# EAGLE design mhvboard (EAGLE 5.10)
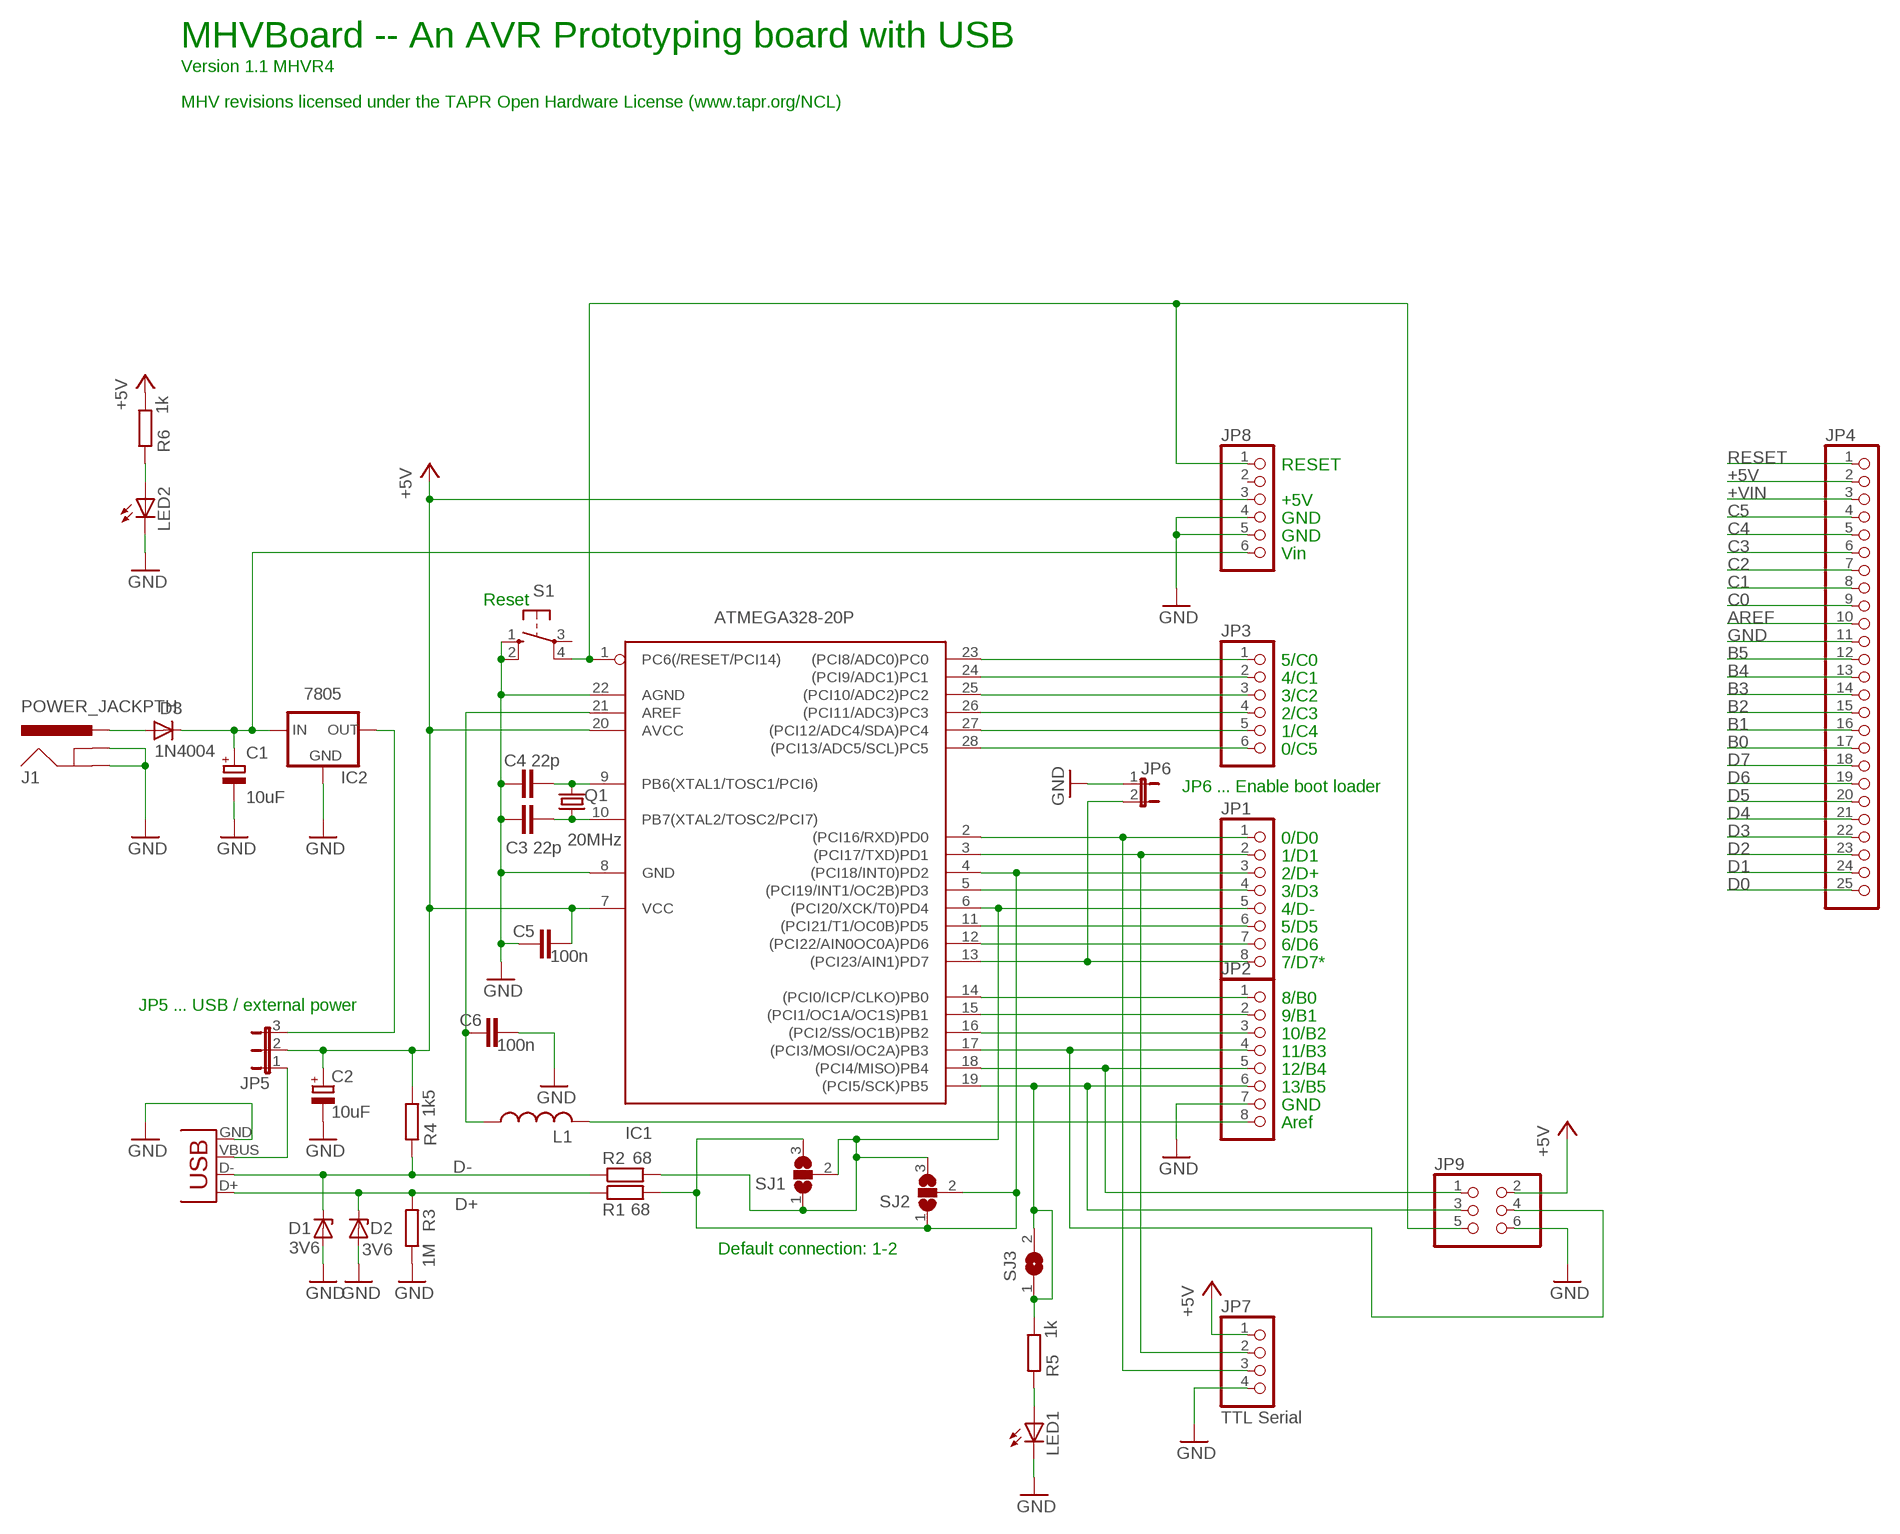
[diagram p0: schematic, sheet 1]

## Parts
C1  10uF  CPOL-EUE2,5-6E  [E2,5-6E]
C2  10uF  CPOL-EUE2,5-6E  [E2,5-6E]
C3  22p  C-EU025-024X044  [C025-024X044]
C4  22p  C-EU025-024X044  [C025-024X044]
C5  100n  C-EU050-024X044  [C050-024X044]
C6  100n  C-EU050-024X044  [C050-024X044]
D1  3V6  ZENER-DIODEDO34-7  [DO34Z7]
D2  3V6  ZENER-DIODEDO34-7  [DO34Z7]
D3  1N4004  [DO41-10]
IC1  ATMEGA328-20P  ATMEGA168-20P  [DIL28-3]
IC2  7805  78XXL  [78XXL]
J1  POWER_JACKPTH  [POWER_JACK_PTH]
JP1  PINHD-1X8  [1X08]
JP2  PINHD-1X8  [1X08]
JP3  PINHD-1X6  [1X06]
JP4  PINHD-1X25  [1X25]
JP5  JP2E  [JP2]
JP6  JP1E  [JP1]
JP7  TTL Serial  PINHD-1X4  [1X04]
JP8  PINHD-1X6  [1X06]
JP9  PINHD-2X3  [2X03]
L1  L-US0207/2V  [0207/2V]
LED1  LED3MM  [LED3MM]
LED2  LED3MM  [LED3MM]
Q1  20MHz  CRYSTALHC49S  [HC49/S]
R1  68  R-EU_0207/10  [0207/10@1]
R2  68  R-EU_0207/10  [0207/10@1]
R3  1M  R-EU_0207/10  [0207/10@1]
R4  1k5  R-EU_0207/10  [0207/10@1]
R5  1k  R-EU_0207/2V  [0207/2V@1]
R6  1k  R-EU_0207/2V  [0207/2V@1]
S1  10-XX  [B3F-10XX]
SJ1  SJ2W  [SJ_2]
SJ2  SJ2W  [SJ_2]
SJ3  SJ  [SJ]
X1  USB-MB-H  [USB-MB-H]

## Nets
+5USB: JP5.1 X1.VBUS
+5V: C2.+ C5.2 IC1.7(VCC) IC1.20(AVCC) JP4.2 JP5.2 JP7.1 JP8.3 JP9.2 R4.1 R6.1
+VIN: C1.+ D3.C IC2.IN JP4.3 JP8.6
AREF: JP2.8 JP4.10 L1.2
AREF_RAW: C6.1 IC1.21(AREF) L1.1
B0: IC1.14((PCI0/ICP/CLKO)PB0) JP2.1 JP4.17
B1: IC1.15((PCI1/OC1A/OC1S)PB1) JP2.2 JP4.16
B2: IC1.16((PCI2/SS/OC1B)PB2) JP2.3 JP4.15
B3: IC1.17((PCI3/MOSI/OC2A)PB3) JP2.4 JP4.14 JP9.4
B4: IC1.18((PCI4/MISO)PB4) JP2.5 JP4.13 JP9.1
B5: IC1.19((PCI5/SCK)PB5) JP2.6 JP4.12 JP9.3 R5.1 SJ3.1 SJ3.2
C0: IC1.23((PCI8/ADC0)PC0) JP3.1 JP4.9
C1: IC1.24((PCI9/ADC1)PC1) JP3.2 JP4.8
C2: IC1.25((PCI10/ADC2)PC2) JP3.3 JP4.7
C3: IC1.26((PCI11/ADC3)PC3) JP3.4 JP4.6
C4: IC1.27((PCI12/ADC4/SDA)PC4) JP3.5 JP4.5
C5: IC1.28((PCI13/ADC5/SCL)PC5) JP3.6 JP4.4
D0: IC1.2((PCI16/RXD)PD0) JP1.1 JP4.25 JP7.3
D1: IC1.3((PCI17/TXD)PD1) JP1.2 JP4.24 JP7.2
D2: IC1.4((PCI18/INT0)PD2) JP1.3 JP4.23 R1.2 SJ1.3 SJ2.1 SJ2.2
D3: IC1.5((PCI19/INT1/OC2B)PD3) JP1.4 JP4.22
D4: IC1.6((PCI20/XCK/T0)PD4) JP1.5 JP4.21 R2.2 SJ1.1 SJ1.2 SJ2.3
D5: IC1.11((PCI21/T1/OC0B)PD5) JP1.6 JP4.20
D6: IC1.12((PCI22/AIN0OC0A)PD6) JP1.7 JP4.19
D7: IC1.13((PCI23/AIN1)PD7) JP1.8 JP4.18 JP6.2
D+: D2.C R1.1 R3.2 X1.D+
D-: D1.C R2.1 R4.2 X1.D-
GND: C1.- C2.- C3.1 C4.1 C5.1 C6.2 D1.A D2.A IC1.8(GND) IC1.22(AGND) IC2.GND J1.GND J1.GNDBREAK JP2.7 JP4.11 JP6.1 JP7.4 JP8.4 JP8.5 JP9.6 LED1.K(C) LED2.K(C) R3.1 S1.1(S) S1.2(S1) X1.GND
N$1: LED1.A R5.2
N$2: LED2.A R6.2
N$4: D3.A J1.PWR
N$8: IC2.OUT JP5.3
N$9: C3.2 IC1.10(PB7(XTAL2/TOSC2/PCI7)) Q1.1
N$10: C4.2 IC1.9(PB6(XTAL1/TOSC1/PCI6)) Q1.2
RESET: IC1.1(PC6(/RESET/PCI14)) JP4.1 JP8.1 JP9.5 S1.4(P1)
Unconnected: JP8.2 S1.3(P)

## Notes on the sheet
- MHVBoard -- An AVR Prototyping board with USB
- Version 1.1 MHVR4
- MHV revisions licensed under the TAPR Open Hardware License (www.tapr.org/NCL)
- RESET
- +5V
- GND
- GND
- Vin
- Reset
- 5/C0
- 4/C1
- 3/C2
- 2/C3
- 1/C4
- 0/C5
- JP6 ... Enable boot loader
- 0/D0
- 1/D1
- 2/D+
- 3/D3
- 4/D-
- 5/D5
- 6/D6
- 7/D7*
- 8/B0
- JP5 ... USB / external power
- 9/B1
- 10/B2
- 11/B3
- 12/B4
- 13/B5
- GND
- Aref
- Default connection: 1-2

## Library data of the parts
C1 C2 = rcl:CPOL-EU: POLARIZED CAPACITOR, European symbol
C3-C6 = rcl:C-EU: CAPACITOR, European symbol
D1 D2 = diode:ZENER-DIODE: Z-Diode
D3 = diode:1N4004: DIODE general purpose rectifier, 1 A
IC1 = avr:ATMEGA168*P: MICROCONTROLLER 16 kBytes FLASH 1 kBytes SRAM 512 Bytes EEPROM USART 8-channel 10 bit ADC
IC2 = v-reg:78XXL: VOLTAGE REGULATOR
J1 = SparkFun:POWER_JACK: Power Jack This is the standard 5.5mm barrel jack for power. The PTH is the most common, proven, reliable, footprint. All others are experimental. The Slot footprint only works if the mill layer is transmitted to the PCB fab house so be warned. Spark Fun Electronics SKU : PRT-00119. Mating wall wart : TOL-00298 (and others)
JP1 JP2 = pinhead:PINHD-1X8: PIN HEADER
JP3 JP8 = pinhead:PINHD-1X6: PIN HEADER
JP4 = pinhead:PINHD-1X25: PIN HEADER
JP5 = jumper:JP2E: JUMPER
JP6 = jumper:JP1E: JUMPER
JP7 = pinhead:PINHD-1X4: PIN HEADER
JP9 = pinhead:PINHD-2X3: PIN HEADER
L1 = rcl:L-US: INDUCTOR, American symbol
LED1 LED2 = led:LED: LED OSRAM: - CHIPLED LG R971, LG N971, LY N971, LG Q971, LY Q971, LO R971, LY R971 LH N974, LH R974 LS Q976, LO Q976, LY Q976 LO Q996 - Hyper CHIPLED LW Q18S LB Q993, LB Q99A, LB R99A - SideLED LS A670, LO A670, LY A670, LG A670, LP A670 LB A673, LV A673, LT A673, LW A673 LH A674 LY A675 LS A676, LA A676, LO A676, LY A676, LW A676 LS A679, LY A679, LG A679 - Hyper Micro SIDELED® LS Y876, LA Y876, LO Y876, LY Y876 LT Y87S - SmartLED LW L88C, LW L88S LB L89C, LB L89S, LG L890 LS L89K, LO L89K, LY L89K LS L896, LA L896, LO L896, LY L896 - TOPLED LS T670, LO T670, LY T670, LG T670, LP T670 LSG T670, LSP T670, LSY T670, LOP T670, LYG T670 LG T671, LOG T671, LSG T671 LB T673, LV T673, LT T673, LW T673 LH T674 LS T676, LA T676, LO T676, LY T676, LB T676, LH T676, LSB T676, LW T676 LB T67C, LV T67C, LT T67C, LS T67K, LO T67K, LY T67K, LW E67C LS E67B, LA E67B, LO E67B, LY E67B, LB E67C, LV E67C, LT E67C LW T67C LS T679, LY T679, LG T679 LS T770, LO T770, LY T770, LG T770, LP T770 LB T773, LV T773, LT T773, LW T773 LH T774 LS E675, LA E675, LY E675, LS T675 LS T776, LA T776, LO T776, LY T776, LB T776 LHGB T686 LT T68C, LB T68C - Hyper Mini TOPLED® LB M676 - Mini TOPLED Santana® LG M470 LS M47K, LO M47K, LY M47K Source: http://www.osram.convergy.de LUXEON: - LUMILED® LXK2-PW12-R00, LXK2-PW12-S00, LXK2-PW14-U00, LXK2-PW14-V00 LXK2-PM12-R00, LXK2-PM12-S00, LXK2-PM14-U00 LXK2-PE12-Q00, LXK2-PE12-R00, LXK2-PE12-S00, LXK2-PE14-T00, LXK2-PE14-U00 LXK2-PB12-K00, LXK2-PB12-L00, LXK2-PB12-M00, LXK2-PB14-N00, LXK2-PB14-P00, LXK2-PB14-Q00 LXK2-PR12-L00, LXK2-PR12-M00, LXK2-PR14-Q00, LXK2-PR14-R00 LXK2-PD12-Q00, LXK2-PD12-R00, LXK2-PD12-S00 LXK2-PH12-R00, LXK2-PH12-S00 LXK2-PL12-P00, LXK2-PL12-Q00, LXK2-PL12-R00 Source: www.luxeon.com KINGBRIGHT: KA-3528ASYC Source: www.kingbright.com
Q1 = crystal:CRYSTAL: CRYSTAL
R1-R6 = rcl:R-EU_: RESISTOR, European symbol
S1 = switch-omron:10-XX: OMRON SWITCH
SJ1 SJ2 = jumper:SJ2W: SMD solder JUMPER
SJ3 = jumper:SJ: SMD solder JUMPER
X1 = SparkFun:USB: USB Connectors USB-B-PTH is fully proven SKU : PRT-00139 USB-miniB is fully proven SKU : PRT-00587 USB-A-PCB is untested. USB-A-H is throughly reviewed, but untested. Spark Fun Electronics SKU : PRT-00437 USB-B-SMT is throughly reviewed, but untested. Needs silkscreen touching up. USB-A-S has not been used/tested USB-MB-H has not been used/tested

## Board
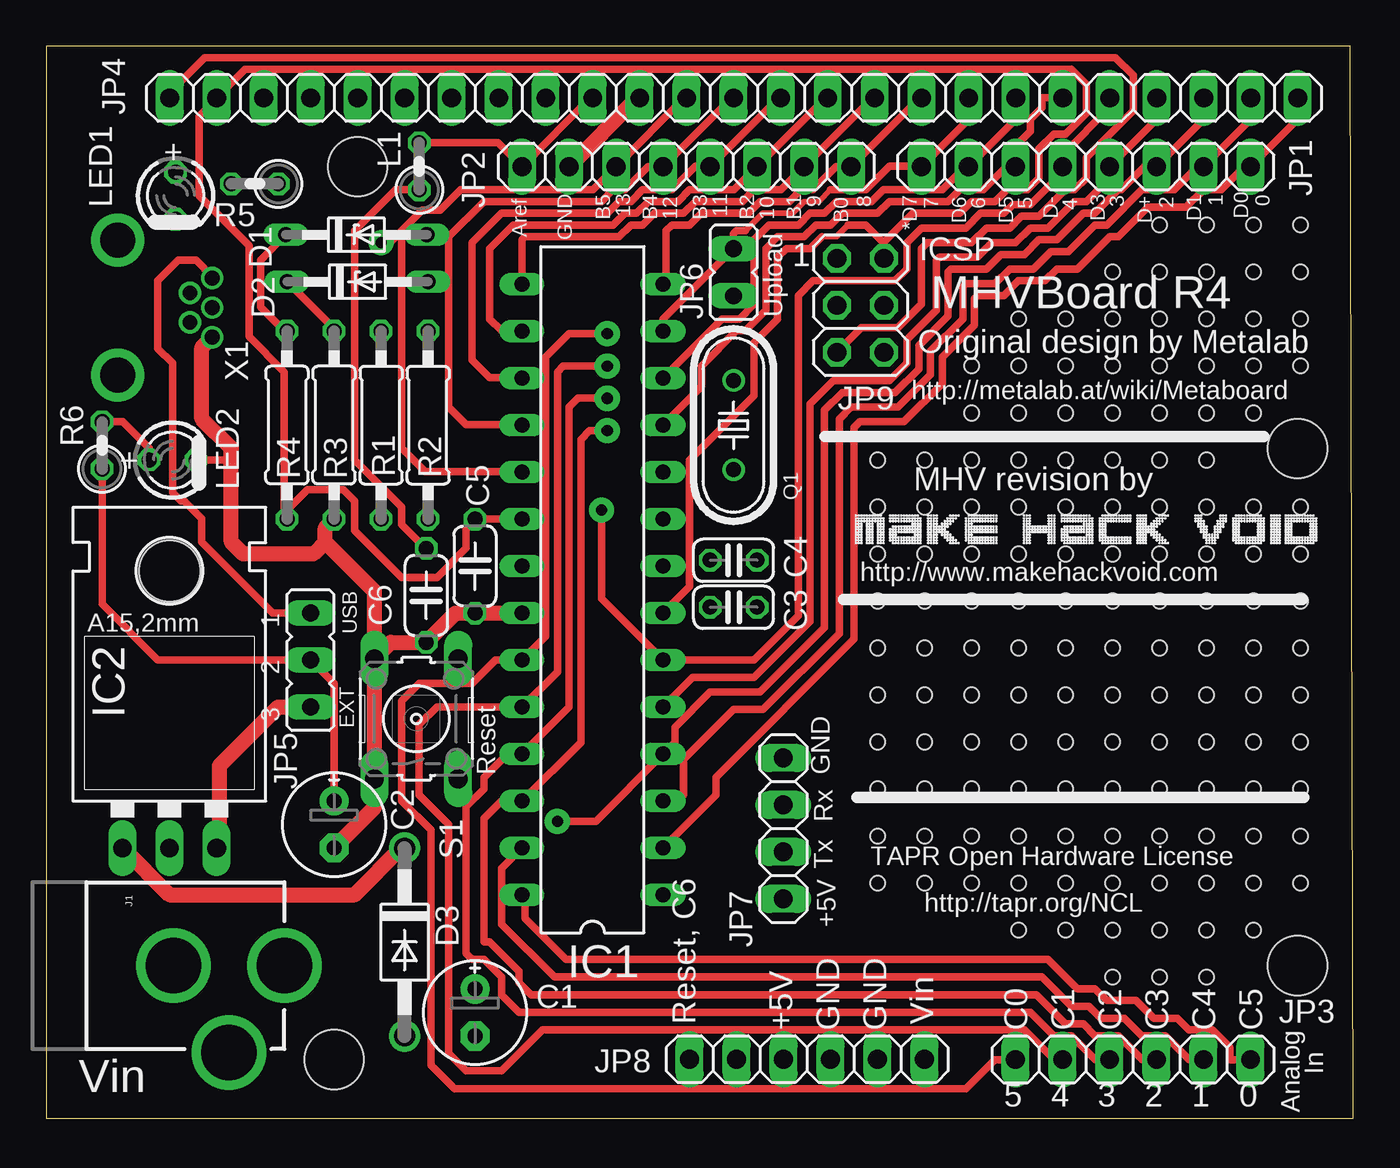
[diagram p1: board, top side]
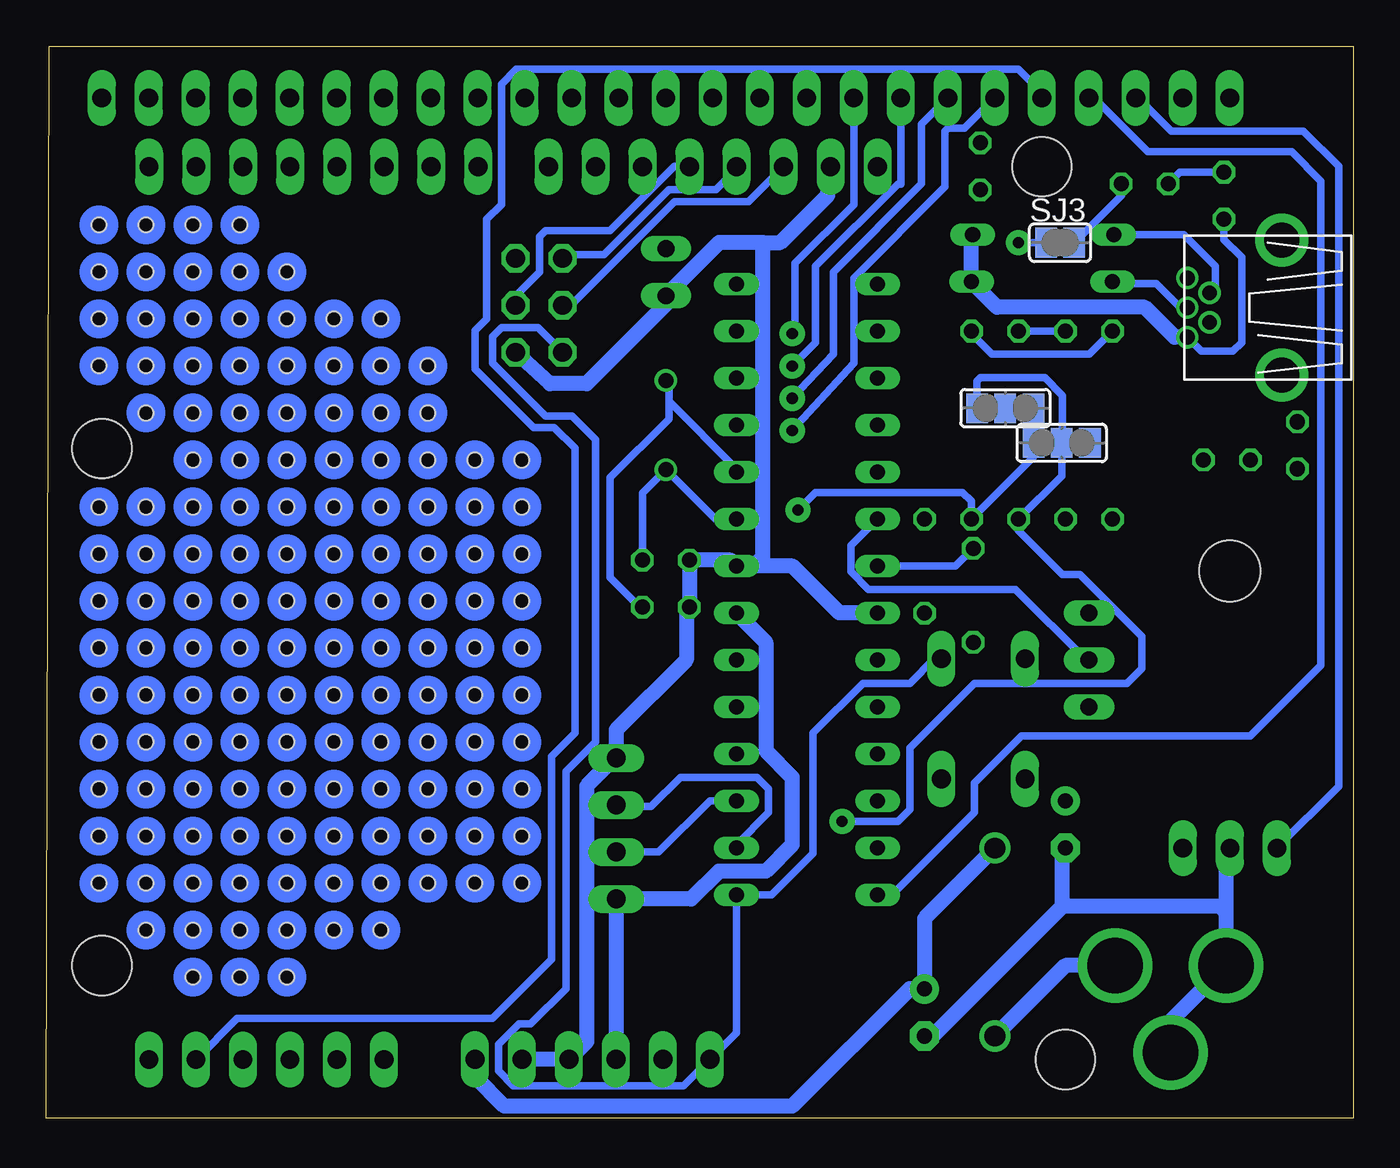
[diagram p2: board, bottom side, seen from below]

Size 70.63 x 57.93 mm. Coordinates in mm from the lower left corner, seen from the top.
Outline: 0,0 70.63,0 70.47,57.93 0,57.93 0,0
Copper layers (1*16): Top 0.035mm / dielectric 1.5mm / Bottom 0.035mm
Design rules "mine *": minimum track width 12mil, minimum drill 12mil, track to track 8mil, track to pad 8mil, pad to pad 8mil, via to via 8mil, smd to smd 8mil, copper to edge 8mil, drill to drill 20mil, minimum pad ring 8mil, minimum via ring 15mil, stop-mask expansion 4mil, vias tented up to drill 0mil, thermal gap 10mil
Holes 3.2 mm at 67.62,36.19 67.62,8.25 16.82,51.43 15.55,3.17
Holes 0.8 mm at 57.62,40.65 60.16,40.65 62.7,40.65 65.24,40.65 65.24,43.19 62.7,43.19 60.16,43.19 57.62,43.19 60.16,45.73 62.7,45.73 65.24,45.73 65.24,48.27 62.7,48.27 57.62,30.49 60.16,30.49 62.7,30.49 65.24,30.49 65.24,33.03 62.7,33.03 60.16,33.03 57.62,33.03 57.62,35.57 60.16,35.57 62.7,35.57 65.24,38.11 62.7,38.11 60.16,38.11 57.62,38.11 57.62,20.33 60.16,20.33 62.7,20.33 65.24,20.33 65.24,22.87 62.7,22.87 60.16,22.87 57.62,22.87 57.62,25.41 60.16,25.41 62.7,25.41 65.24,25.41 65.24,27.95 62.7,27.95 60.16,27.95 57.62,27.95 57.62,10.17 60.16,10.17 62.7,10.17 65.24,10.17 65.24,12.71 62.7,12.71 60.16,12.71 57.62,12.71 57.62,15.25 60.16,15.25 62.7,15.25 65.24,15.25 65.24,17.79 62.7,17.79 60.16,17.79 57.62,17.79 67.78,40.65 67.78,43.19 67.78,45.73 67.78,48.27 67.78,25.41 67.78,27.95 67.78,30.49 67.78,33.03 67.78,15.25 67.78,17.79 67.78,20.33 67.78,22.87 67.78,12.71 47.46,33.03 50,33.03 52.54,33.03 55.08,33.03 55.08,35.57 52.54,35.57 50,35.57 47.46,35.57 50,38.11 52.54,38.11 55.08,38.11 55.08,40.65 52.54,40.65 47.46,22.87 50,22.87 52.54,22.87 55.08,22.87 55.08,25.41 52.54,25.41 50,25.41 47.46,25.41 47.46,27.95 50,27.95 52.54,27.95 55.08,27.95 55.08,30.49 52.54,30.49 50,30.49 47.46,30.49 47.46,12.71 50,12.71 52.54,12.71 55.08,12.71 55.08,15.25 52.54,15.25 50,15.25 47.46,15.25 47.46,17.79 50,17.79 52.54,17.79 55.08,17.79 55.08,20.33 52.54,20.33 50,20.33 47.46,20.33 52.54,10.17 55.08,10.17 44.92,12.71 44.92,15.25 44.92,17.79 44.92,20.33 57.62,7.63 60.16,7.63 62.7,7.63 55.08,43.19 57.62,45.73 60.16,48.27 52.54,43.19 50,40.65 44.92,27.95 44.92,30.49 44.92,22.87 44.92,25.41 44.92,33.03 44.92,35.57
bRestrict: area 14.1,48.7 to 19.5,54.1

### Footprints (pad centres in the part's own frame; a part is rotated, then mirrored left to right if it is on the bottom)
E2,5-6E = drill 0.813 pad 1.575 round: + -1.27,0 | drill 0.813 pad 1.575 octagon: - 1.27,0
C025-024X044 = drill 0.813 octagon: 1 -1.27,0; 2 1.27,0
C050-024X044 = drill 0.813 octagon: 1 -2.54,0; 2 2.54,0
DO34Z7 = drill 0.813 long: A 3.81,0; C -3.81,0
DO41-10 = drill 1.118 round: A 5.08,0; C -5.08,0
DIL28-3 = drill 0.813 long: 1 -16.51,-3.81; 2 -13.97,-3.81; 3 -11.43,-3.81; 4 -8.89,-3.81; 5 -6.35,-3.81; 6 -3.81,-3.81; 7 -1.27,-3.81; 8 1.27,-3.81; 9 3.81,-3.81; 10 6.35,-3.81; 11 8.89,-3.81; 12 11.43,-3.81; 13 13.97,-3.81; 14 16.51,-3.81; 15 16.51,3.81; 16 13.97,3.81; 17 11.43,3.81; 18 8.89,3.81; 19 6.35,3.81; 20 3.81,3.81; 21 1.27,3.81; 22 -1.27,3.81; 23 -3.81,3.81; 24 -6.35,3.81; 25 -8.89,3.81; 26 -11.43,3.81; 27 -13.97,3.81; 28 -16.51,3.81
78XXL = drill 1.016 long: GND 0,-3.81; IN -2.54,-3.81; OUT 2.54,-3.81 | hole 3.302: 0,11.176
POWER_JACK_PTH = drill 2.997 round: GND 0,7.7; GNDBREAK 4.7,10.7; PWR 0,13.7
1X08 = drill 1.016 long: 1 -8.89,0; 2 -6.35,0; 3 -3.81,0; 4 -1.27,0; 5 1.27,0; 6 3.81,0; 7 6.35,0; 8 8.89,0
1X06 = drill 1.016 long: 1 -6.35,0; 2 -3.81,0; 3 -1.27,0; 4 1.27,0; 5 3.81,0; 6 6.35,0
1X25 = drill 1.016 long: 1 -29.21,0; 2 -26.67,0; 3 -24.13,0; 4 -21.59,0; 5 -19.05,0; 6 -16.51,0; 7 -13.97,0; 8 -11.43,0; 9 -8.89,0; 10 -6.35,0; 11 -3.81,0; 12 -1.27,0; 13 1.27,0; 14 3.81,0; 15 6.35,0; 16 8.89,0; 17 11.43,0; 18 13.97,0; 19 16.51,0; 20 19.05,0; 21 21.59,0; 22 24.13,0; 23 26.67,0; 24 29.21,0; 25 31.75,0
JP2 = drill 0.914 long: 1 -2.54,0; 2 0,0; 3 2.54,0
JP1 = drill 0.914 long: 1 0,-1.27; 2 0,1.27
1X04 = drill 1.016 long: 1 -3.81,0; 2 -1.27,0; 3 1.27,0; 4 3.81,0
2X03 = drill 1.016 octagon: 1 -2.54,-1.27; 2 -2.54,1.27; 3 0,-1.27; 4 0,1.27; 5 2.54,-1.27; 6 2.54,1.27
0207/2V = drill 0.813 octagon: 1 -1.27,0; 2 1.27,0
LED3MM = drill 0.813 octagon: A -1.27,0; K 1.27,0
HC49/S = drill 0.813 round: 1 -2.413,0; 2 2.413,0
0207/10@1 = drill 0.813 octagon: 1 -5.08,0; 2 5.08,0
0207/2V@1 = drill 0.813 octagon: 1 -1.27,0; 2 1.27,0
B3F-10XX = drill 1.016 long: 1 -3.251,2.261; 2 3.251,2.261; 3 -3.251,-2.261; 4 3.251,-2.261
SJ_2 = smd 1.168 x 1.6: 1 -1.524,0; 2 0,0; 3 1.524,0
SJ = smd 1.168 x 1.6: 1 -0.762,0; 2 0.762,0
USB-MB-H = drill 0.8 pad 1.143 round: D+ 5.1,0; D- 3.9,0.8; GND 5.1,-1.6; ID 3.9,-0.8; VBUS 5.1,1.6 | drill 1.9 round: P$6 0,-3.65; P$7 0,3.65

### Placement (x,y rotation side)
C1  23.17,5.71 270 top
C2  15.55,15.87 270 top
C3  37.14,27.62 0 top
C4  37.14,30.16 0 top
C5  23.17,29.84 90 top
C6  20.53,28.26 270 top
D1  16.76,47.75 0 top
D2  16.82,45.21 0 top
D3  19.36,9.52 270 top
IC1  29.52,28.57 90 top
IC2  6.66,18.41 0 top
J1  -0.83,8.25 270 top
JP1  56.19,51.43 180 top
JP2  34.6,51.43 180 top
JP3  58.73,3.17 0 top
JP4  35.88,55.14 0 top
JP5  14.28,24.76 270 top
JP6  37.14,45.72 0 top
JP7  39.83,15.66 90 top
JP8  41.11,3.19 0 top
JP9  44,43.93 270 top
L1  20.16,51.45 90 top
LED1  6.98,49.86 270 top
LED2  6.82,35.57 0 top
Q1  37.14,37.46 270 top
R1  18.09,37.46 270 top
R2  20.63,37.46 270 top
R3  15.55,37.46 90 top
R4  13.01,37.46 90 top
R5  11.27,50.5 180 top
R6  3.01,36.37 90 top
S1  20,21.59 90 top
SJ1  18.8,38.37 180 bottom
SJ2  15.75,36.49 180 bottom
SJ3  15.84,47.32 0 bottom
X1  3.87,43.81 0 top

### Tracks (layer width: path | path; a pad name or v marks a point on that pad's centre or on a via)
+5USB
  Top 0.406: X1.VBUS 8.97,45.49 8.09,46.37 7.14,46.37 6.03,45.26 6.03,41.61 6.82,40.81 6.82,33.83 7.3,33.35 7.46,33.35 8.41,32.4 8.41,31.13 12.22,27.32 14.26,27.32 JP5.1
+5V
  Top 0.305: 43.34,48.27 42.7,47.64 41.91,47.64
  Top 0.406: IC1.20 C5.2 22.7,31.91 22.7,30.81 21.11,29.22 19.21,29.22 16.67,31.76 16.67,33.35 16.03,33.98 14.13,33.98 13.01,32.87 R4.1 12.86,32.53 12.86,40.33 10.95,42.24 10.95,47.16 8.25,49.86 8.25,54.15 9.21,55.11 JP4.2 10.76,56.69 55.4,56.69 56.2,55.89 56.2,54.3 55.08,53.19 54.45,53.19 53.66,52.4 53.66,50.81 53.02,50.18 51.91,50.18 51.27,49.54 50,49.54 49.37,48.91 46.83,48.91 45.27,47.35 JP9.2 45.27,47.29 44.29,48.27 43.34,48.27 | C2.+ 15.55,23.49 JP5.2 14.26,24.78 6.03,24.78 3.01,27.79 R6.1 | IC1.7 34.76,28.73 34.76,35.57 38.26,39.07 38.26,41.92 39.53,43.19 39.53,46.53 40,47 41.27,47 41.91,47.64
  Bottom 0.406: JP5.2 14.43,24.76 18.25,28.59 26.19,28.59 27.14,29.54 27.14,30.95 IC1.20
  Bottom 0.813: JP8.3 39.84,11.83 JP7.1 35.79,11.85 34.29,13.35 31.75,13.35 30.32,14.78 30.32,18.43 31.75,19.86 31.75,25.72 IC1.7
+VIN
  Top 0.813: D3.C 19.19,14.6 16.67,12.08 6.64,12.08 IC2.IN
  Bottom 0.406: 4.13,15.41 4.44,15.09 4.44,14.92 IC2.IN 0.79,17.93 0.79,51.45 2.7,53.35 9.84,53.35 11.63,55.14 JP4.3
  Bottom 0.813: D3.C 23.17,10.79 C1.+ 23.19,7 23.97,7 30.32,0.65 45.88,0.65 47.46,2.24 JP8.6
AREF
  Top 0.406: JP4.10 29.42,55.14 JP2.8 24.42,52.72 L1.2
AREF_RAW
  Top 0.406: C6.1 20.49,30.8 19.21,32.08 19.21,33.03 16.67,35.57 16.67,47.96 18.89,50.18 L1.1
  Bottom 0.406: IC1.21 21.49,29.84 C6.1
B0
  Top 0.406: JP4.17 47.2,55.14 JP2.1 42.68,51.43 41.43,50.18 40.8,50.18 40.16,49.54 38.57,49.54 37.94,48.91 35.4,48.91 34.76,48.27 33.81,48.27 33.49,47.96 33.49,45.24 IC1.14
B1
  Top 0.406: JP4.16 44.66,55.14 JP2.2 39.7,50.18 38.26,50.18 37.62,49.54 35.08,49.54 34.45,48.91 32.86,48.91 32.22,48.27 31.59,48.27 30.95,47.64 25.87,47.64 25.71,47.47 IC1.15
B2
  Top 0.406: JP4.15 42.12,55.14 JP2.3 37.16,50.18 34.76,50.18 34.13,49.54 32.54,49.54 31.91,48.91 31.27,48.91 30.64,48.27 25.24,48.27 23.97,47 23.97,43.19 24.6,42.56 25.69,42.56 IC1.16
B3
  Top 0.406: JP4.14 39.58,55.14 JP2.4 35.85,51.45 35.08,51.45 33.81,50.18 32.22,50.18 31.59,49.54 30.95,49.54 30.32,48.91 24.6,48.91 23.02,47.32 23.02,40.97 23.97,40.02 25.69,40.02 IC1.17
  Bottom 0.406: JP9.4 45.27,44.43 43.97,45.73 43.97,47.64 43.65,47.96 40.16,47.96 36.67,51.45 35.89,51.45 JP2.4
B4
  Top 0.406: JP4.13 37.04,55.14 JP2.5 32.52,51.43 31.27,50.18 30.64,50.18 30,49.54 23.65,49.54 21.75,47.64 21.75,38.43 22.7,37.48 25.69,37.48 IC1.18
  Bottom 0.406: JP2.5 33.33,51.29 34.45,50.18 36.99,50.18 40.48,46.68 42.68,46.68 JP9.1
B5  (via drill 0.6)
  Top 0.406: JP4.12 34.5,55.14 JP2.6 29.54,50.18 22.38,50.18 21.27,49.07 20.32,49.07 19.21,47.96 | 19.21,47.96 19.21,36.21 20.48,34.94 25.69,34.94 IC1.19 | 18.25,47.32 18.57,47.32 | 18.25,47.32 18.57,47.32 19.21,47.96 | 18.25,47.32 v18.1,47.32
  Bottom 0.406: IC1.19 25.54,35.1 | JP9.3 42.12,44.09 36.67,49.54 32.68,49.54 JP2.6 | R5.1 12.54,49.86 SJ3.2 SJ3.1 v18.1,47.32
C0  (via drill 0.6)
  Top 0.406: JP3.1 51.26,3.17 49.69,1.6 22.06,1.6 20.79,2.87 20.79,15.57 19.21,17.16 19.21,22.56 20.16,23.51 23.02,23.51 24.29,24.78 25.69,24.78 IC1.23 26.99,26.03 26.99,41.13 28.26,42.4 v30.32,42.4
  Bottom 0.406: JP4.9 26.99,49.38 30.16,46.21 30.16,42.56 v30.32,42.4
C1  (via drill 0.6)
  Top 0.406: JP3.2 54.47,3.17 52.86,4.78 26.83,4.78 24.6,2.55 22.7,2.55 21.75,3.51 21.75,15.89 20.16,17.47 20.16,21.29 21.11,22.24 25.69,22.24 IC1.24 27.62,24.13 27.62,40.33 27.94,40.65 v30.32,40.65
  Bottom 0.406: JP4.8 24.45,50.49 24.61,50.49 29.05,46.05 29.05,41.92 v30.32,40.65
C2  (via drill 0.6)
  Top 0.406: JP3.3 56.69,3.17 55.4,4.46 54.45,4.46 53.18,5.73 25.56,5.73 24.6,6.68 24.6,7.63 23.65,8.58 23.02,8.58 22.7,8.9 22.7,16.84 23.65,17.79 23.65,18.43 24.92,19.7 25.69,19.7 IC1.25 28.26,22.22 28.26,38.43 28.73,38.91 v30.32,38.91
  Bottom 0.406: 28.1,45.73 28.1,41.29 v30.32,38.91 | 28.1,45.73 | 28.1,45.73 23.33,50.5 23.33,53.72 JP4.7
C3  (via drill 0.6)
  Top 0.406: JP3.4 59.23,3.17 57.94,4.46 56.67,4.46 56.04,5.09 55.08,5.09 53.5,6.68 26.19,6.68 25.56,7.32 25.56,7.95 23.97,9.54 23.65,9.54 23.65,16.2 24.6,17.16 25.69,17.16 IC1.26 28.89,20.32 28.89,36.68 29.37,37.16 v30.32,37.16
  Bottom 0.406: v30.32,37.16 26.99,40.81 26.99,45.42 22.06,50.34 22.06,53.35 21.91,53.51 21,53.51 JP4.6
C4
  Top 0.406: JP3.5 61.77,3.17 60.48,4.46 59.21,4.46 58.26,5.41 56.99,5.41 56.35,6.04 55.4,6.04 53.81,7.63 27.46,7.63 24.6,10.49 24.6,13.49 IC1.27
  Bottom 0.406: JP4.5 16.83,55.42 18.1,56.69 45.24,56.69 46.04,55.89 46.04,49.38 46.83,48.59 46.83,43.19 47.46,42.56 47.46,40.49 44.29,37.32 43.18,37.32 42.07,36.21 42.07,20.81 43.34,19.54 43.34,8.58 46.51,5.41 60.3,5.41 JP3.5
C5
  Top 0.406: JP3.6 63.99,3.17 63.97,3.19 63.97,3.82 63.02,4.78 61.75,4.78 61.12,5.41 59.85,5.41 58.89,6.36 57.31,6.36 56.67,7 55.72,7 54.13,8.58 28.1,8.58 25.87,10.81 25.87,11.9 IC1.28
  Bottom 0.406: IC1.28 24.94,12.06 20.48,16.52 20.48,18.11 17.94,20.65 5.55,20.65 1.74,24.46 1.74,50.65 3.33,52.24 11.11,52.24 14.01,55.14 JP4.4
D0
  Top 0.406: JP4.25 67.63,53.98 JP1.1 64.75,51.43 63.5,50.18 62.55,50.18 61.59,49.22 59.53,49.22 57.94,47.64 57.47,47.64 55.72,45.89 54.61,45.89 53.97,45.26 52.54,45.26 51.75,44.46 50.32,44.46 50.16,44.3 50.16,42.88 48.42,41.13 48.42,39.7 46.35,37.64 43.97,37.64 43.65,37.32 43.65,25.89 36.19,18.43 36.19,17.46 IC1.2
  Bottom 0.406: IC1.2 33.33,14.78 31.59,16.52 31.59,17.79 32.22,18.43 36.35,18.43 37.94,16.84 39.74,16.84 JP7.3
D1
  Top 0.406: JP4.24 65.09,53.98 JP1.2 62.21,51.43 60.96,50.18 59.21,50.18 57.31,48.27 56.67,48.27 55.24,46.84 54.29,46.84 53.34,45.89 52.07,45.89 51.27,45.1 49.69,45.1 49.53,44.94 49.53,43.19 47.78,41.45 47.78,40.18 46.04,38.43 43.5,38.43 42.86,37.79 42.86,26.21 38.73,22.08 37.15,22.08 34.45,19.38 34.45,17.47 34.13,17.16 33.35,17.16 IC1.3
  Bottom 0.406: JP7.2 37.53,14.39 34.76,17.16 33.35,17.16 IC1.3
D2  (via drill 0.6)
  Top 0.406: JP4.23 62.55,53.98 JP1.3 59.35,51.43 58.1,50.18 57.94,50.18 56.67,48.91 56.04,48.91 54.61,47.48 53.66,47.48 52.86,46.68 51.59,46.68 50.8,45.89 48.89,45.89 48.73,45.73 48.73,43.35 47.15,41.76 47.15,40.49 45.88,39.22 43.02,39.22 42.07,38.27 42.07,26.52 38.57,23.03 35.88,23.03 33.97,21.13 33.97,20.32 IC1.4 29.7,16.05 v27.62,16.05
  Bottom 0.406: SJ2.2 SJ2.1 | SJ2.2 15.75,34.72 R1.2 18.09,31.76 15.71,29.38 14.76,29.38 11.43,26.05 11.43,24.3 12.22,23.51 20.48,23.51 23.97,20.02 23.97,16.68 24.6,16.05 v27.62,16.05 | SJ1.3 20.33,39.85 20.16,40.02 16.67,40.02 15.71,39.07 15.71,36.53 SJ2.2
D3
  Top 0.406: JP4.22 60.01,53.98 JP1.4 57.46,50.81 56.2,49.54 55.56,49.54 54.13,48.11 53.18,48.11 52.39,47.32 51.12,47.32 50.32,46.53 48.26,46.53 48.1,46.37 48.1,43.67 46.51,42.08 46.51,40.81 45.56,39.86 42.54,39.86 41.27,38.59 41.27,26.84 38.26,23.82 34.94,23.82 IC1.5
D4  (via drill 0.6)
  Top 0.406: JP4.21 57.47,54.63 54.93,52.08 JP1.5 | JP1.5 | JP1.5 54.93,51.13 53.18,49.38 52.23,49.38 51.75,48.91 50.48,48.91 49.69,48.11 47.31,48.11 46.51,47.32 46.51,45.89 45.88,45.26 41.43,45.26 40.64,44.46 40.64,27.16 38.26,24.78 33.35,24.78 IC1.6 30,28.09 v30,32.87
  Bottom 0.406: SJ1.2 SJ1.1 SJ2.3 17.28,35.73 R2.2 20.63,33.35 21.11,33.83 29.05,33.83 v30,32.87
D5
  Top 0.406: IC1.11 35.4,39.53 35.4,40.65 37.3,42.56 37.78,42.56 38.89,43.67 38.89,47 39.53,47.64 40.96,47.64 41.59,48.27 42.38,48.27 43.02,48.91 44.92,48.91 45.56,49.54 48.73,49.54 49.37,50.18 50.64,50.18 51.89,51.43 JP1.6 52.23,51.58 52.23,52.4 53.18,53.35 53.18,53.99 53.81,54.62 53.81,55.14 JP4.20
D6
  Top 0.406: JP4.19 52.39,53.98 JP1.7 49.67,51.43 48.42,50.18 45.24,50.18 44.61,49.54 42.7,49.54 42.07,48.91 41.27,48.91 40.64,48.27 39.05,48.27 38.26,47.48 38.26,43.99 37.46,43.19 36.52,43.19 IC1.12
D7
  Top 0.305: 42.38,50.18 41.75,49.54 40.96,49.54 40.32,48.91 38.73,48.91 37.78,47.96
  Top 0.406: JP4.18 49.85,53.98 JP1.8 47.28,51.45 45.56,51.45 44.29,50.18 42.38,50.18 | IC1.13 33.33,43.18 JP6.2 37.15,47.8 37.3,47.96 37.78,47.96
D+
  Top 0.406: R3.2 15.55,42.67 D2.C
  Bottom 0.406: X1.D+ 9.35,43.81 10.63,45.1 12.9,45.1 D2.C | R3.2 R1.1
D-
  Top 0.406: R4.2 12.87,42.54 11.59,43.83 11.59,46.39 D1.C
  Bottom 0.406: D1.C 9.16,47.75 7.46,46.05 7.46,44.92 X1.D- | R2.1 20.63,42.39 19.52,41.29 14.26,41.29 R4.2
GND
  Top 0.406: 31.96,55.14 JP4.11 | 10,35.57 LED2.K
  Top 0.813: IC1.22 C5.1 22.12,27.3 C6.2 18.62,25.72 S1.2 | S1.2 S1.1 17.74,16.78 C2.- | S1.2 17.74,28.47 15.08,31.13 | 15.08,31.13 15.08,31.91 R3.1 | 15.08,31.13 14.44,30.49 10.63,30.49 10,31.13 10,35.57 10,36.21 8.41,37.79 8.41,41.65 X1.GND | JP2.7 31.96,55.14
  Bottom 0.406: 28.4,51.15 28.4,51.43 | LED1.K 6.98,47.48 6.03,46.53 6.03,41.92 6.51,41.45 8.2,41.45 X1.GND
  Bottom 0.813: J1.GNDBREAK 9.87,5.25 J1.GND 6.87,11.13 | 6.87,11.13 6.87,14.39 IC2.GND | C1.- 22.72,4.44 15.71,11.44 | 15.71,11.44 15.71,14.44 C2.- | JP8.5 JP8.4 41.43,4.14 41.43,17.95 39.91,19.47 JP7.4 39.83,20.98 36.03,24.78 36.03,27.45 C3.1 C4.1 33.65,30.16 IC1.8 32.38,29.84 | 32.38,29.84 30.3,29.84 27.78,27.32 25.73,27.32 IC1.22 | X1.GND 9.65,42.21 11.27,43.83 19.25,43.83 D2.A 20.63,47.68 D1.A | 28.4,51.43 JP2.7 | 15.71,11.44 7.19,11.44 6.87,11.13 | 28.4,51.15 28.4,49.88 30.95,47.32 31.91,47.32 | 31.91,47.32 34.27,47.32 JP6.1 37.14,43.99 41.43,39.7 43.42,39.7 JP9.6 | 32.38,29.84 31.91,30.32 31.91,47.32
N$1
  Bottom 0.406: LED1.A 9.36,51.13 R5.2
N$2
  Top 0.406: LED2.A 5.55,36.21 4.13,37.64 R6.2 | R6.2
N$4
  Bottom 0.813: J1.PWR 15.55,8.25 D3.A
N$8
  Top 0.813: JP5.3 12.52,22.22 9.36,19.06 9.36,14.76 IC2.OUT
N$9
  Bottom 0.406: IC1.10 33.33,35.09 36.99,38.75 | 36.99,38.75 36.99,39.72 Q1.1 | C3.2 38.56,27.62 40.16,29.22 40.16,34.62 36.99,37.79 36.99,38.75
N$10
  Bottom 0.406: IC1.9 34.47,32.38 Q1.2 38.41,33.78 C4.2
RESET
  Top 0.406: JP4.1 6.67,55.42 8.57,57.32 57.78,57.32 58.74,56.37 58.74,54.46 56.2,51.92 56.2,50.81 55.56,50.18 55.08,50.18 53.66,48.75 52.7,48.75 52.07,48.11 50.8,48.11 50,47.32 47.62,47.32 47.31,47 47.31,43.99 46.04,42.72 44.05,42.72 JP9.5
  Bottom 0.406: S1.4 22.64,24.84 23.97,23.51 26.51,23.51 29.21,20.81 29.21,14.3 31.43,12.08 33.31,12.08 IC1.1 33.33,4.62 JP8.1 36.19,1.76 45.4,1.76 46.19,2.55 46.19,3.98 45.08,5.09 44.45,5.09 42.54,7 42.54,18.75 40.96,20.33 40.96,36.68 42.23,37.95 43.65,37.95 46.51,40.81 46.51,42.24 46.04,42.72 44.05,42.72 JP9.5
(copper drawn outside any net)
  shapes: Bottom circle x138

### Text on the board
tPlace: D1 | B5 | B4 | B3 | B2 | B1 | 9 | 8 | 7 | 6 | 5 | D- | 4 | 3 | 2 | 1 | D0 | 0 | Aref | B0 | *D7 | D6 | D5 | D3 | D+ | GND | MHVBoard R4 | Upload | Reset | +5V | GND | GND | Vin | C0 | C1 | C2 | C3 | C4 | C5 | Vin | 5 | 4 | 3 | 2 | 1 | 0
tNames: + | 13 | 12 | 11 | 10 | 1 | ICSP | Original design by Metalab | http://metalab.at/wiki/Metaboard | + | MHV revision by | A:/eagle/Metaboard-MHV/mhv.bmp | http://www.makehackvoid.com | USB | EXT | GND | Rx | TAPR Open Hardware License | Tx | http://tapr.org/NCL | +5V | Reset, C6 | In | Analog